# EAGLE design Adafruit Motor Bonnet Rev A (EAGLE 9.2.2)
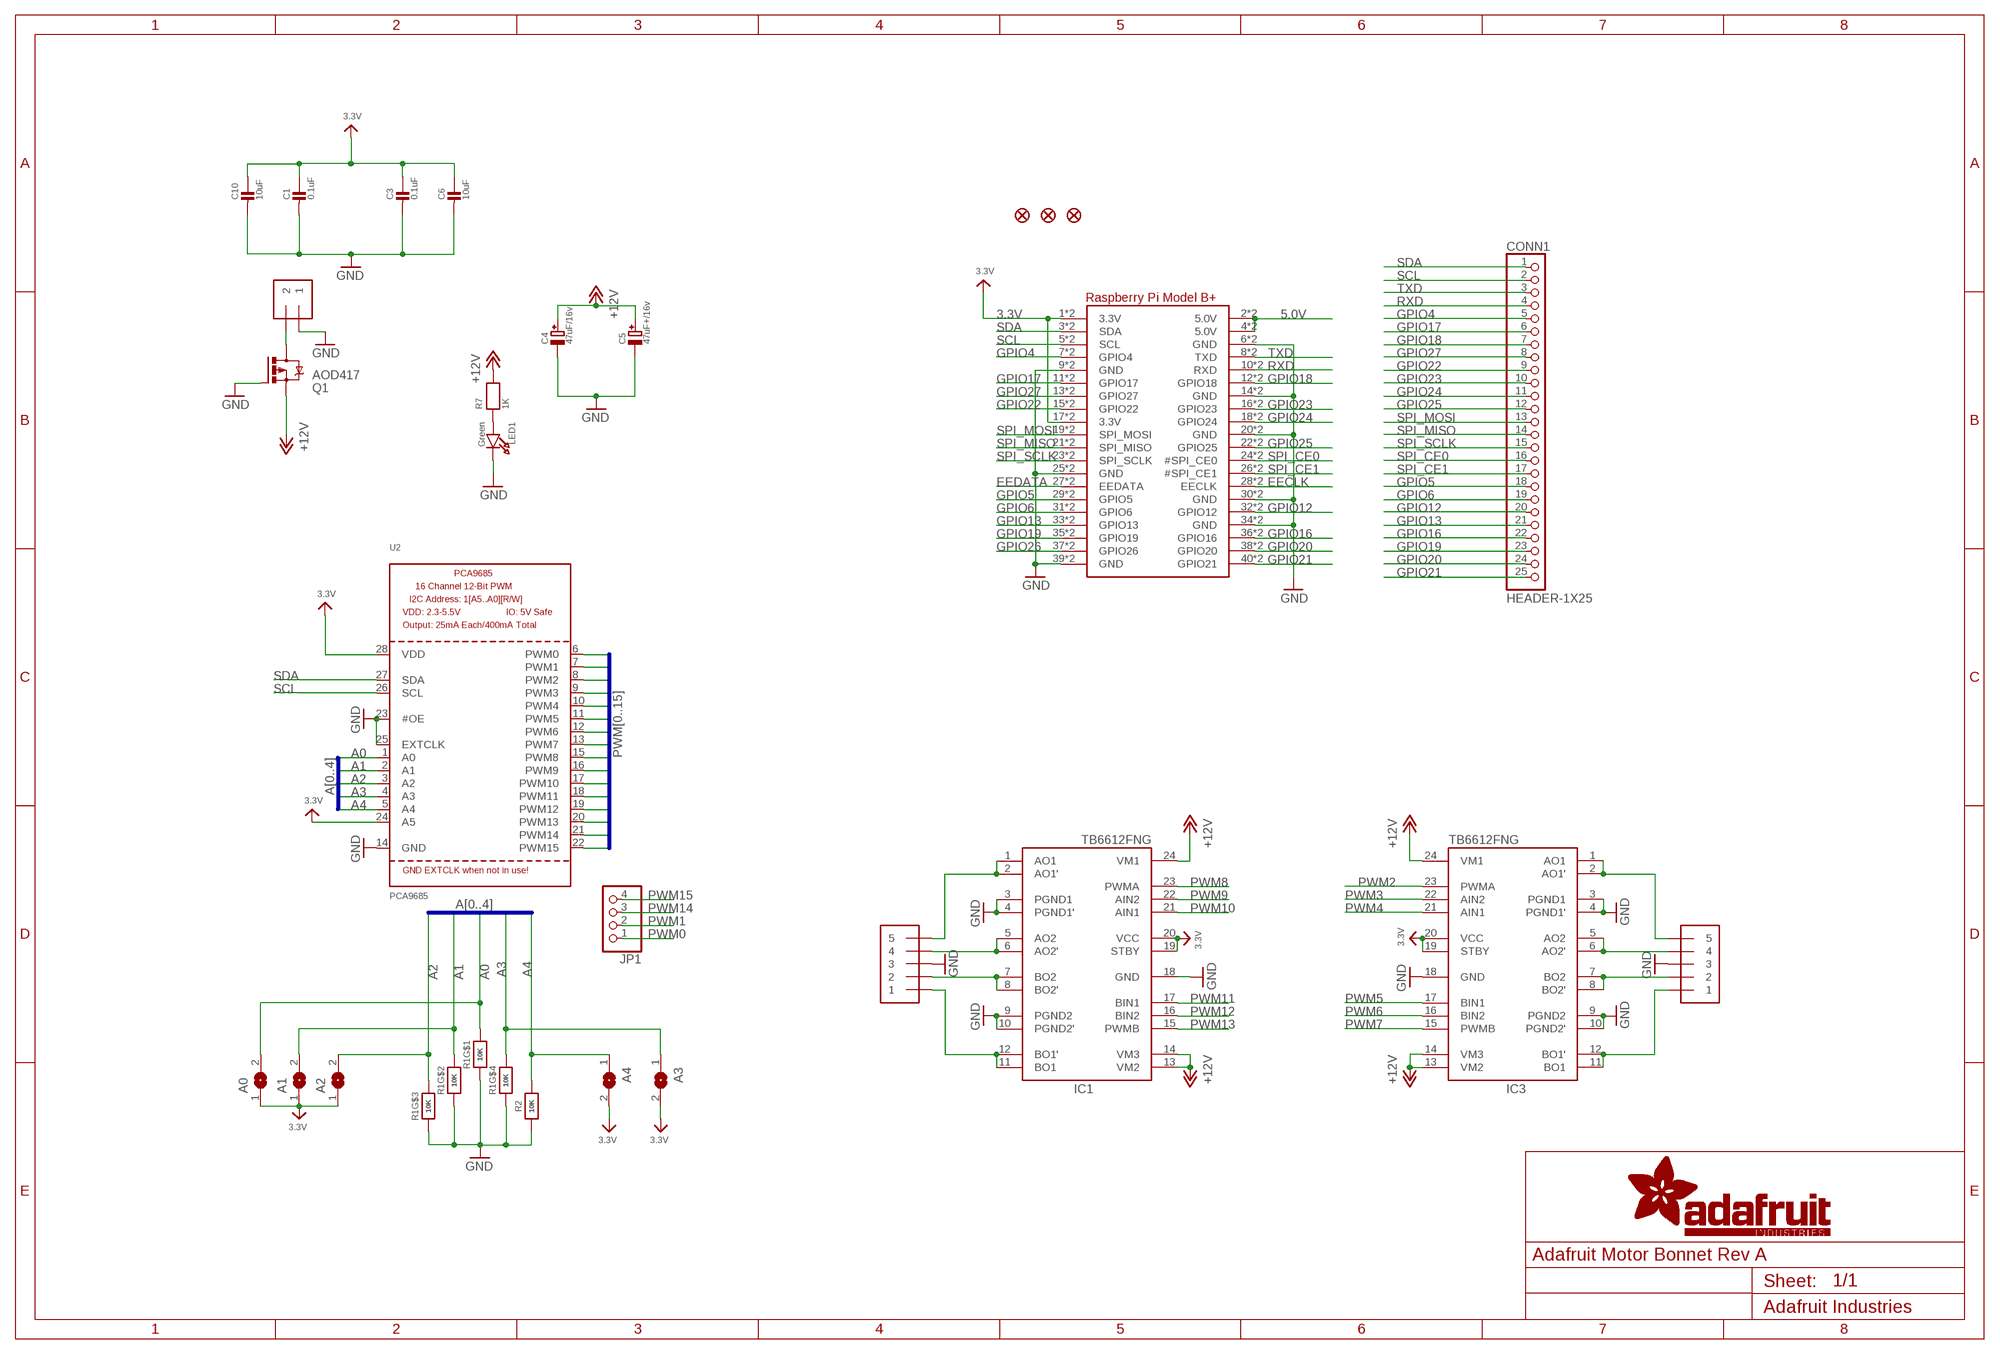
[diagram p0: schematic, sheet 1]

## Parts
A0  SOLDERJUMPERREFLOW_NOPASTE  [SOLDERJUMPER_REFLOW_NOPASTE]
A1  SOLDERJUMPERREFLOW_NOPASTE  [SOLDERJUMPER_REFLOW_NOPASTE]
A2  SOLDERJUMPERREFLOW_NOPASTE  [SOLDERJUMPER_REFLOW_NOPASTE]
A3  SOLDERJUMPERREFLOW_NOPASTE  [SOLDERJUMPER_REFLOW_NOPASTE]
A4  SOLDERJUMPERREFLOW_NOPASTE  [SOLDERJUMPER_REFLOW_NOPASTE]
C1  0.1uF  CAP_CERAMIC0603_NO  [0603-NO]
C3  0.1uF  CAP_CERAMIC0603_NO  [0603-NO]
C4  47uF/16v  CAP_ELECTROLYTICPANASONIC_C  [PANASONIC_C]
C5  47uF+/16v  CAP_ELECTROLYTICPANASONIC_C  [PANASONIC_C]
C6  10uF  CAP_CERAMIC0805-NOOUTLINE  [0805-NO]
C10  10uF  CAP_CERAMIC0805-NOOUTLINE  [0805-NO]
CONN1  HEADER-1X25  [1X25_ROUND_70MIL]
FID1  FIDUCIAL_1MM  [FIDUCIAL_1MM]
FID2  FIDUCIAL_1MM  [FIDUCIAL_1MM]
FID3  FIDUCIAL_1MM  [FIDUCIAL_1MM]
IC1  TB6612FNG  [SSOP24]
IC3  TB6612FNG  [SSOP24]
J1  1X5  [1X05-3.5MM]
J3  1X5  [1X05-3.5MM]
JP1  HEADER-1X4ROUND  [1X04_ROUND]
LED1  Green  LED0805_NOOUTLINE  [CHIPLED_0805_NOOUTLINE]
MPOWER  1X2-3.5MM  [1X2-3.5MM]
Q1  AOD417  IRFR5305  [D-PAK_TO252AA]
R1  10K  RESISTOR_4PACK  [RESPACK_4X0603]
R2  10K  RESISTOR_0603_NOOUT  [0603-NO]
R7  1K  RESISTOR_0603_NOOUT  [0603-NO]
RPI1  RASPBERRYPI_BPLUS_BONNET_THMSMT  [PI_BONNET_THMSMT]
U2  PCA9685  [TSSOP28]

## Nets
3.3V: A0.1 A1.1 A2.1 A3.2 A4.2 C1.1 C3.1 C6.1 C10.1 IC1.19(STBY) IC1.20(VCC) IC3.19(STBY) IC3.20(VCC) RPI1.1(3.3V) RPI1.17(3.3V) RPI1.S1(3.3V) RPI1.S17(3.3V) U2.24(A5) U2.28(VDD)
5.0V: RPI1.2(5.0V) RPI1.4(5.0V) RPI1.S2(5.0V) RPI1.S4(5.0V)
+12V: C4.+ C5.+ IC1.13(VM2) IC1.14(VM3) IC1.24(VM1) IC3.13(VM2) IC3.14(VM3) IC3.24(VM1) Q1.3(S) R7.2
A0: A0.2 R1.8 U2.1(A0)
A1: A1.2 R1.7 U2.2(A1)
A2: A2.2 R1.6 U2.3(A2)
A3: A3.1 R1.5 U2.4(A3)
A4: A4.1 R2.2 U2.5(A4)
EECLK: RPI1.28(EECLK) RPI1.S28(EECLK)
EEDATA: RPI1.27(EEDATA) RPI1.S27(EEDATA)
GND: C1.2 C3.2 C4.- C5.- C6.2 C10.2 IC1.3(PGND1) IC1.4(PGND1') IC1.9(PGND2) IC1.10(PGND2') IC1.18(GND) IC3.3(PGND1) IC3.4(PGND1') IC3.9(PGND2) IC3.10(PGND2') IC3.18(GND) J1.3 J3.3 LED1.C MPOWER.1 Q1.1(G) R1.1 R1.2 R1.3 R1.4 R2.1 RPI1.6(GND) RPI1.9(GND) RPI1.14(GND) RPI1.20(GND) RPI1.25(GND) RPI1.30(GND) RPI1.34(GND) RPI1.39(GND) RPI1.S6(GND) RPI1.S9(GND) RPI1.S14(GND) RPI1.S20(GND) RPI1.S25(GND) RPI1.S30(GND) RPI1.S34(GND) RPI1.S39(GND) U2.14(GND) U2.23(#OE) U2.25(EXTCLK)
GPIO4: CONN1.5 RPI1.7(GPIO4) RPI1.S7(GPIO4)
GPIO5: CONN1.18 RPI1.29(GPIO5) RPI1.S29(GPIO5)
GPIO6: CONN1.19 RPI1.31(GPIO6) RPI1.S31(GPIO6)
GPIO12: CONN1.20 RPI1.32(GPIO12) RPI1.S32(GPIO12)
GPIO13: CONN1.21 RPI1.33(GPIO13) RPI1.S33(GPIO13)
GPIO16: CONN1.22 RPI1.36(GPIO16) RPI1.S36(GPIO16)
GPIO17: CONN1.6 RPI1.11(GPIO17) RPI1.S11(GPIO17)
GPIO18: CONN1.7 RPI1.12(GPIO18) RPI1.S12(GPIO18)
GPIO19: CONN1.23 RPI1.35(GPIO19) RPI1.S35(GPIO19)
GPIO20: CONN1.24 RPI1.38(GPIO20) RPI1.S38(GPIO20)
GPIO21: CONN1.25 RPI1.40(GPIO21) RPI1.S40(GPIO21)
GPIO22: CONN1.9 RPI1.15(GPIO22) RPI1.S15(GPIO22)
GPIO23: CONN1.10 RPI1.16(GPIO23) RPI1.S16(GPIO23)
GPIO24: CONN1.11 RPI1.18(GPIO24) RPI1.S18(GPIO24)
GPIO25: CONN1.12 RPI1.22(GPIO25) RPI1.S22(GPIO25)
GPIO26: RPI1.37(GPIO26) RPI1.S37(GPIO26)
GPIO27: CONN1.8 RPI1.13(GPIO27) RPI1.S13(GPIO27)
M1A: IC1.1(AO1) IC1.2(AO1') J1.5
M1B: IC1.5(AO2) IC1.6(AO2') J1.4
M2A: IC1.11(BO1) IC1.12(BO1') J1.1
M2B: IC1.7(BO2) IC1.8(BO2') J1.2
M3A: IC3.1(AO1) IC3.2(AO1') J3.5
M3B: IC3.5(AO2) IC3.6(AO2') J3.4
M4A: IC3.11(BO1) IC3.12(BO1') J3.1
M4B: IC3.7(BO2) IC3.8(BO2') J3.2
N$1: LED1.A R7.1
PWM0: JP1.1 U2.6(PWM0)
PWM1: JP1.2 U2.7(PWM1)
PWM2: IC3.23(PWMA) U2.8(PWM2)
PWM3: IC3.22(AIN2) U2.9(PWM3)
PWM4: IC3.21(AIN1) U2.10(PWM4)
PWM5: IC3.17(BIN1) U2.11(PWM5)
PWM6: IC3.16(BIN2) U2.12(PWM6)
PWM7: IC3.15(PWMB) U2.13(PWM7)
PWM8: IC1.23(PWMA) U2.15(PWM8)
PWM9: IC1.22(AIN2) U2.16(PWM9)
PWM10: IC1.21(AIN1) U2.17(PWM10)
PWM11: IC1.17(BIN1) U2.18(PWM11)
PWM12: IC1.16(BIN2) U2.19(PWM12)
PWM13: IC1.15(PWMB) U2.20(PWM13)
PWM14: JP1.3 U2.21(PWM14)
PWM15: JP1.4 U2.22(PWM15)
RXD: CONN1.4 RPI1.10(RXD) RPI1.S10(RXD)
SCL: CONN1.2 RPI1.5(SCL) RPI1.S5(SCL) U2.26(SCL)
SDA: CONN1.1 RPI1.3(SDA) RPI1.S3(SDA) U2.27(SDA)
SPI_CE0: CONN1.16 RPI1.24(#SPI_CE0) RPI1.S24(#SPI_CE0)
SPI_CE1: CONN1.17 RPI1.26(#SPI_CE1) RPI1.S26(#SPI_CE1)
SPI_MISO: CONN1.14 RPI1.21(SPI_MISO) RPI1.S21(SPI_MISO)
SPI_MOSI: CONN1.13 RPI1.19(SPI_MOSI) RPI1.S19(SPI_MOSI)
SPI_SCLK: CONN1.15 RPI1.23(SPI_SCLK) RPI1.S23(SPI_SCLK)
TXD: CONN1.3 RPI1.8(TXD) RPI1.S8(TXD)
VMOTOR: MPOWER.2 Q1.4(D)

## Buses
PWM[0..15]
A[0..4]

## Library data of the parts
A0 A1-A4 = microbuilder:SOLDERJUMPER: SMD Solder JUMPER Solder the two pads together to create a connection, or remove the solder to break it. REFLOW - Use this footprint for solder paste and reflow ovens. WAVE - Use this footprint for hand-soldering (larger pads). CLOSED - Has a trace between the two pads to ensure it is closed by default. The trace needs to be cut to disable the jumper, and can be closed again by creating a solder bridge between the two pads.
C1 C3 C6 C10 = microbuilder:CAP_CERAMIC: Ceramic Capacitors For new designs, use the packages preceded by an '_' character since they are more reliable: The following footprints should be used on most boards: _0402 - Standard footprint for regular board layouts _0603 - Standard footprint for regular board layouts _0805 - Standard footprint for regular board layouts _1206 - Standard footprint for regular board layouts For extremely tight-pitch boards where space is at a premium, the following 'micro-pitch' footprints can be used (smaller pads, no silkscreen outline, etc.): _0402MP - Micro-pitch footprint for very dense/compact boards _0603MP - Micro-pitch footprint for very dense/compact boards _0805MP - Micro-pitch footprint for very dense/compact boards _1206MP - Micro-pitch footprint for very dense/compact boards
C4 C5 = microbuilder:CAP_ELECTROLYTIC: Electrolytic Capacitors SMT PANASONIC_C - Size C Panasonic Electrolytic Aluminum Capacitor 47µF 16V 20% Electrolytic Capacitor [Digikey: PCE3890TR-ND] PANASONIC_D - Size D Panasonic Electrolytic Aluminum Capacitor 100µF 25V 20% Electrolytic Capacitor [Digikey: PCE3898TR-ND] PTH 3.5 mm grid, 8 mm diameter ... 3.5 mm grid, 10 mm diameter ...
CONN1 = microbuilder:HEADER-1X25
FID1-FID3 = microbuilder:FIDUCIAL: Fiducial Alignment Points Various fiducial points for machine vision alignment.; BOM: EXCLUDE
IC1 IC3 = adafruit:TB6612FNG: TB6612FNG MOS dual H-bridge motor driver, 1.2A current 3.2A peak 3 or 5v logic and 3-15v motor
J1 J3 = adafruit:1X5
JP1 = microbuilder:HEADER-1X4: PIN HEADER
LED1 = microbuilder:LED: LED 0603 - 0603 Surface Mount Package 2mA: Green LED - Low Power (3.9mcd, 2ma, 1.7Vf) - Digikey: 475-2709-2-ND Orange LED - Low Power (9.8mcd, 2ma, 1.8Vf) - Digikey: 475-1194-2-ND Red LED - Low Power (5mcd, 2ma, 1.8Vf) - Digikey: 475-1195-2-ND Yellow LED - Low Power (7mcd, 2ma, 1.8Vf) - Digikey: 475-1196-2-ND 5mA: Blue LED - Low Power (17mcd, 5ma, 2.9Vf) - Digikey: LNJ937W8CRACT-ND 0805 - 0805 Surface Mount Package 2mA: Red LED (8.8mcd, 2mA, 1.8Vf, Clear) - Low Power [Digikey: 475-2510-1-ND] Green LED (5mcd, 2mA, 1.8Vf, Clear) - Low Power [Digikey: 475-2730-1-ND] Yellow LED (11.3mcd, 2mA, 1.8Vf, Clear) - Low Power [Digikey: 475-2555-1-ND] 20mA: Red LED (104mcd, 20mA, Diffused) - LS R976 [Digikey: 475-1278-6-ND] Red LED (12mcd, 20mA, 2.0Vf, Clear) - APT2012EC [Digikey: 754-1128-1-ND] Green LED (15mcd, 20mA, 2.2Vf, Clear) - APT2012GC [Digikey: 754-1131-1-ND] Orange LED (160mcd, 20mA, 2.1Vf, Clear) - APT2012SECK [Digikey: 754-1130-1-ND] 1206 - 1206 Surface Mount Package Green LED (26mcd, 20mA, Diffused) - LG N971 [Digikey: 475-1407-6-ND] Red LED (15mcd, 20mA, Diffused) - LH N974 [Digikey: 475-1416-6-ND] Cree - Cree High-Power Surface Mount LEDs XPEBWT-L1-0000-00D50 - White 111lm 350mA 2.9Vf 6200K 110° XTEAWT-00-0000-00000LEE3 - White 114lm 350mA 2.85Vf 5000K 115° Everlight - Everlight 45-21 Series Surface Mount LEDs 45-21/QK2C-B2832AC2CB2/2T - Warm White 2000mcd 20mA 3.25Vf 3050K 120° 45-21/LK2C-B38452C4CB2/2T - Nuetral White 2000mcd 20mA 3.25Vf 4150K 120° 45-21/LK2C-B50634C6CB2/2T - Cold White 2200mcd 20mA 3.25Vf 5650K 120° PLCC2 Reverse Mount LS T77K-J1L2-1-0-2-R18-Z - Red 11.25mcd 2mA 1.8Vf 630nm 120° LO T77K-L1M2-24-Z - Orange 19.6mcd 2mA 1.8Vf 606nm 120° LY T77K-K2M1-26-Z - Yellow 15.7mcd 2mA 1.8Vf 587nm 120°
MPOWER = adafruit:1X2: 3.5mm Terminal block http://www.ladyada.net/library/pcb/eaglelibrary.html
Q1 = transistor-power:IRF?5305: HEXFET Power MOSFET Source: http://www.irf.com/product-info/datasheets/data/irfr5305pbf.pdf
R1 = microbuilder:RESISTOR_4PACK: Resistor Packs (4 resistors) 4 x 0603 10K 1/16W - Digikey: YC164J-10KCT-ND
R2 R7 = microbuilder:RESISTOR: Resistors For new designs, use the packages preceded by an '_' character since they are more reliable: The following footprints should be used on most boards: _0402 - Standard footprint for regular board layouts _0603 - Standard footprint for regular board layouts _0805 - Standard footprint for regular board layouts _1206 - Standard footprint for regular board layouts For extremely tight-pitch boards where space is at a premium, the following 'micro-pitch' footprints can be used (smaller pads, no silkscreen outline, etc.): _0402MP - Micro-pitch footprint for very dense/compact boards _0603MP - Micro-pitch footprint for very dense/compact boards _0805MP - Micro-pitch footprint for very dense/compact boards _1206MP - Micro-pitch footprint for very dense/compact boards
RPI1 = microbuilder:RASPBERRYPI_BPLUS
U2 = microbuilder:PCA9685: PCA9685 - 16 Channel 12-Bit I2C PWM Controller 5.0V tolerant 16 channel, 12-bit I2C PWM controller with 25mA per output (max. 400mA total) Digikey: 568-5931-1-ND

## Board
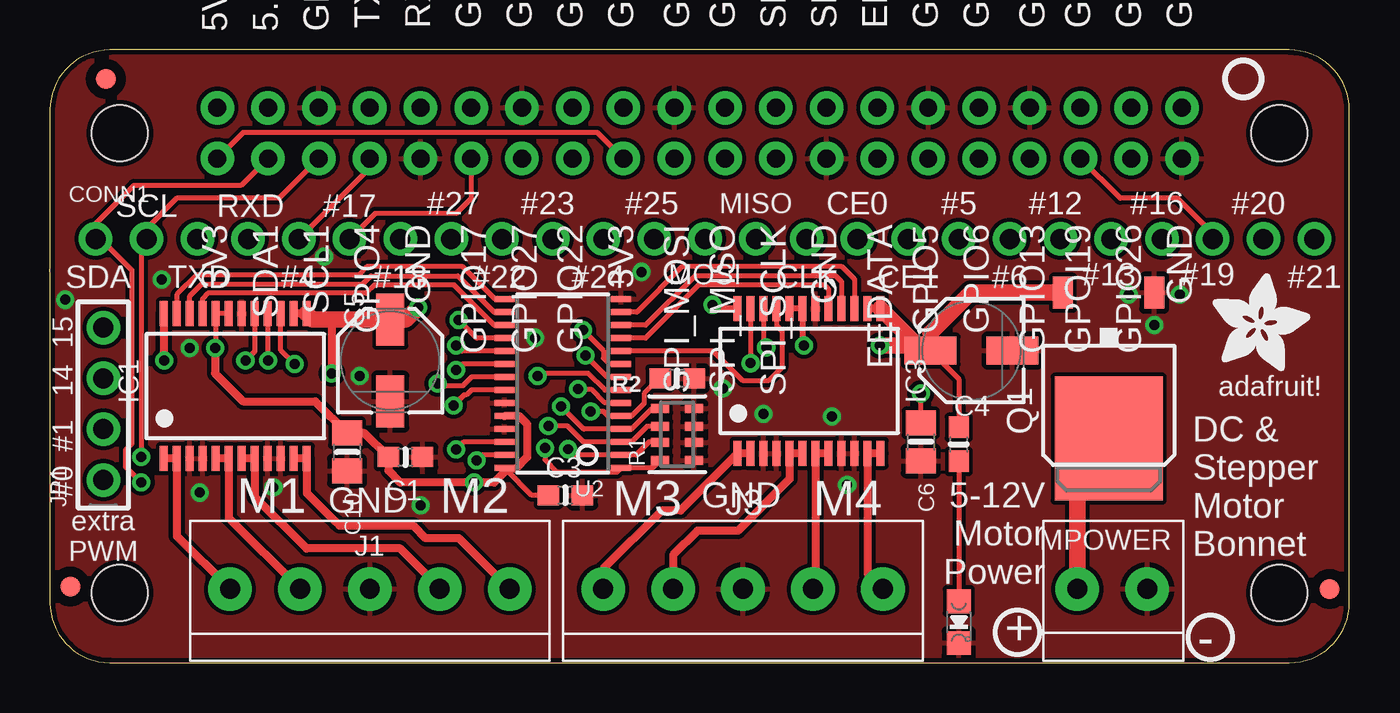
[diagram p1: board, top side]
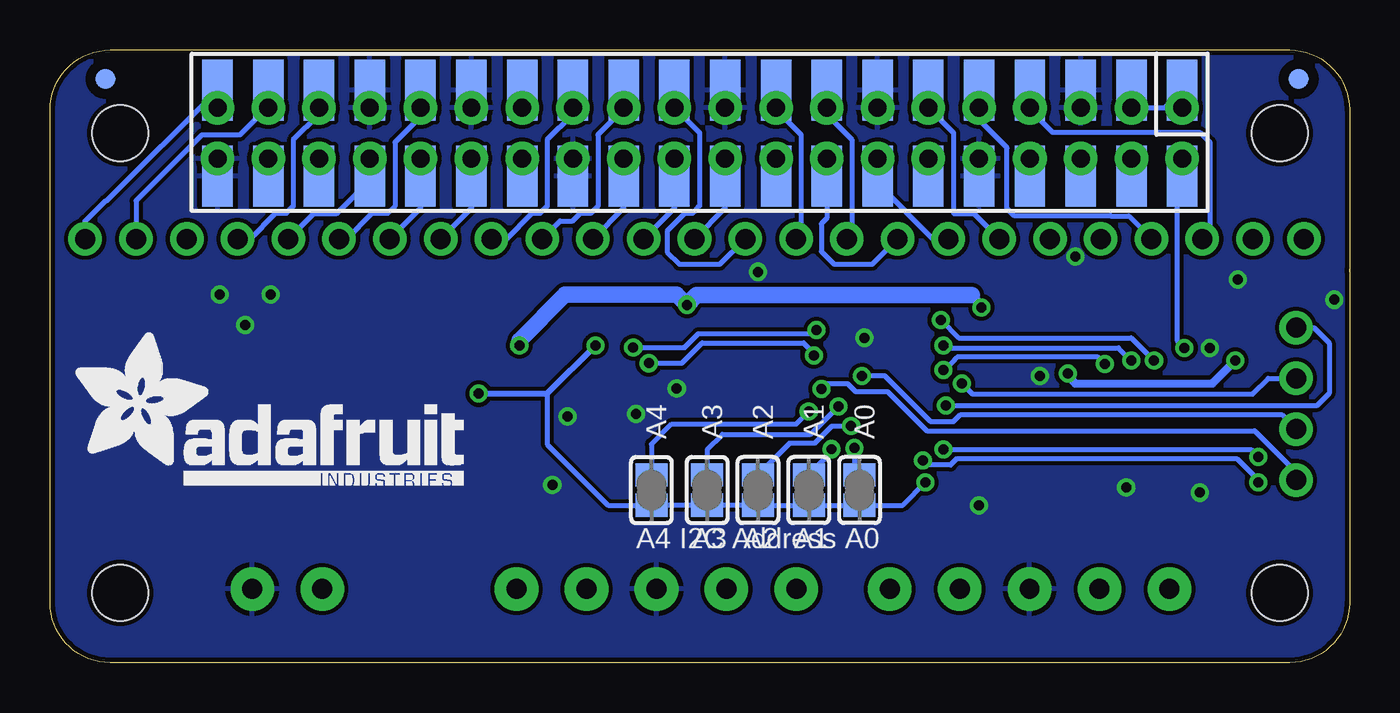
[diagram p2: board, bottom side, seen from below]

Size 65 x 30.66 mm. Coordinates in mm from the lower left corner, seen from the top.
Outline: 0,19.56 0,19.68
Copper layers (1*16): Top 0.035mm / dielectric 1.5mm / Bottom 0.035mm
Design rules "adafruit *": minimum track width 8mil, minimum drill 15.5mil, track to track 8mil, track to pad 8mil, pad to pad 8mil, via to via 8mil, smd to smd 8mil, copper to edge 10mil, drill to drill 8mil, minimum pad ring 10mil, minimum via ring 8mil, stop-mask expansion 2mil, vias tented up to drill 20mil, thermal gap 10mil

### Footprints (pad centres in the part's own frame; a part is rotated, then mirrored left to right if it is on the bottom)
SOLDERJUMPER_REFLOW_NOPASTE = smd 1.168 x 1.6: 1 -0.762,0; 2 0.762,0
0603-NO = smd 1.075 x 1: 1 -0.85,0; 2 0.85,0
PANASONIC_C = smd 2.6 x 1.4: + 2.05,0; - -2.05,0
0805-NO = smd 1.24 x 1.5: 1 -0.95,0; 2 0.95,0
1X25_ROUND_70MIL = drill 1 pad 1.676: 1 -30.48,0; 2 -27.94,0; 3 -25.4,0; 4 -22.86,0; 5 -20.32,0; 6 -17.78,0; 7 -15.24,0; 8 -12.7,0; 9 -10.16,0; 10 -7.62,0; 11 -5.08,0; 12 -2.54,0; 13 0,0; 14 2.54,0; 15 5.08,0; 16 7.62,0; 17 10.16,0; 18 12.7,0; 19 15.24,0; 20 17.78,0; 21 20.32,0; 22 22.86,0; 23 25.4,0; 24 27.94,0; 25 30.48,0
FIDUCIAL_1MM = smd 1 x 1: 1 0,0
SSOP24 = smd 0.4 x 1.25: 1 -3.575,-3.625; 2 -2.925,-3.625; 3 -2.275,-3.625; 4 -1.625,-3.625; 5 -0.975,-3.625; 6 -0.325,-3.625; 7 0.325,-3.625; 8 0.975,-3.625; 9 1.625,-3.625; 10 2.275,-3.625; 11 2.925,-3.625; 12 3.575,-3.625; 13 3.575,3.625; 14 2.925,3.625; 15 2.275,3.625; 16 1.625,3.625; 17 0.975,3.625; 18 0.325,3.625; 19 -0.325,3.625; 20 -0.975,3.625; 21 -1.625,3.625; 22 -2.275,3.625; 23 -2.925,3.625; 24 -3.575,3.625
1X05-3.5MM = drill 1 pad 2.184: 1 7,0; 2 3.5,0; 3 0,0; 4 -3.5,0; 5 -7,0
1X04_ROUND = drill 1 pad 1.676: 1 -3.81,0; 2 -1.27,0; 3 1.27,0; 4 3.81,0
CHIPLED_0805_NOOUTLINE = smd 1.2 x 1.2: A 0,-1.05; C 0,1.05
1X2-3.5MM = drill 1 pad 2.184: 1 1.8,0; 2 -1.7,0
D-PAK_TO252AA = smd 1 x 1.6: 1 -2.28,-4.8; 3 2.28,-4.8 | smd 5.4 x 6.2: 4 0,2.5
RESPACK_4X0603 = smd 0.45 x 0.9: 1 -1.3,-0.85; 2 -0.4,-0.85; 3 0.4,-0.85; 4 1.3,-0.85; 5 1.3,0.85; 6 0.4,0.85; 7 -0.4,0.85; 8 -1.3,0.85
PI_BONNET_THMSMT = drill 0.9 pad 1.676: 1 8.37,25.23; 2 8.37,27.77; 3 10.91,25.23; 4 10.91,27.77; 5 13.45,25.23; 6 13.45,27.77; 7 15.99,25.23; 8 15.99,27.77; 9 18.53,25.23; 10 18.53,27.77; 11 21.07,25.23; 12 21.07,27.77; 13 23.61,25.23; 14 23.61,27.77; 15 26.15,25.23; 16 26.15,27.77; 17 28.69,25.23; 18 28.69,27.77; 19 31.23,25.23; 20 31.23,27.77; 21 33.77,25.23; 22 33.77,27.77; 23 36.31,25.23; 24 36.31,27.77; 25 38.85,25.23; 26 38.85,27.77; 27 41.39,25.23; 28 41.39,27.77; 29 43.93,25.23; 30 43.93,27.77; 31 46.47,25.23; 32 46.47,27.77; 33 49.01,25.23; 34 49.01,27.77; 35 51.55,25.23; 36 51.55,27.77; 37 54.09,25.23; 38 54.09,27.77; 39 56.63,25.23; 40 56.63,27.77 | smd 1 x 1 bottom: 41 2.54,29.21; 42 62.23,29.21 | smd 1.524 x 3.048 bottom: S1 8.37,24.339; S2 8.37,28.657; S3 10.91,24.339; S4 10.91,28.657; S5 13.45,24.339; S6 13.45,28.657; S7 15.99,24.339; S8 15.99,28.657; S9 18.53,24.339; S10 18.53,28.657; S11 21.07,24.339; S12 21.07,28.657; S13 23.61,24.339; S14 23.61,28.657; S15 26.15,24.339; S16 26.15,28.657; S17 28.69,24.339; S18 28.69,28.657; S19 31.23,24.339; S20 31.23,28.657; S21 33.77,24.339; S22 33.77,28.657; S23 36.31,24.339; S24 36.31,28.657; S25 38.85,24.339; S26 38.85,28.657; S27 41.39,24.339; S28 41.39,28.657; S29 43.93,24.339; S30 43.93,28.657; S31 46.47,24.339; S32 46.47,28.657; S33 49.01,24.339; S34 49.01,28.657; S35 51.55,24.339; S36 51.55,28.657; S37 54.09,24.339; S38 54.09,28.657; S39 56.63,24.339; S40 56.63,28.657 | hole 2.8: 3.5,26.5; 61.5,26.5; 61.5,3.5; 3.5,3.5
TSSOP28 = smd 0.305 x 0.991: 1 -4.225,-2.918; 2 -3.575,-2.918; 3 -2.925,-2.918; 4 -2.275,-2.918; 5 -1.625,-2.918; 6 -0.975,-2.918; 7 -0.325,-2.918; 8 0.325,-2.918; 9 0.975,-2.918; 10 1.625,-2.918; 11 2.275,-2.918; 12 2.925,-2.918; 13 3.575,-2.918; 14 4.225,-2.918; 15 4.225,2.918; 16 3.575,2.918; 17 2.925,2.918; 18 2.275,2.918; 19 1.625,2.918; 20 0.975,2.918; 21 0.325,2.918; 22 -0.325,2.918; 23 -0.975,2.918; 24 -1.625,2.918; 25 -2.275,2.918; 26 -2.925,2.918; 27 -3.575,2.918; 28 -4.225,2.918

### Placement (x,y rotation side)
A0  24.51,8.64 90 bottom
A1  27.05,8.64 90 bottom
A2  29.59,8.64 90 bottom
A3  32.13,8.64 270 bottom
A4  34.92,8.64 270 bottom
C1  17.78,10.29 0 top
C3  25.78,8.38 0 top
C4  46.1,15.62 180 top
C5  17.02,15.11 90 top
C6  43.56,11.05 270 top
C10  14.86,10.54 270 top
CONN1  32.77,21.21 0 top
FID1  2.79,29.21 0 top
FID2  64.01,3.68 0 top
FID3  1.02,3.81 0 top
IC1  9.27,13.84 0 top
IC3  37.97,14.1 0 top
J1  16,3.68 0 top
J3  34.67,3.68 0 top
JP1  2.67,12.95 90 top
LED1  45.47,2.03 180 top
MPOWER  53.09,3.68 0 top
Q1  52.96,13.72 180 top
R1  31.37,11.43 90 top
R2  31.37,14.22 180 top
R7  45.47,10.92 90 top
RPI1  0,0 0 top
U2  25.65,13.97 90 top
U$6  [PCBFEAT-REV-040]  59.69,29.21 0 top
U$8  [ADAFRUIT_TEXT_20MM]  63.88,8.89 0 bottom
U$51  [ADAFRUIT_5MM]  58.17,14.61 0 top

### Tracks (layer width: path | path; a pad name or v marks a point on that pad's centre or on a via)
3.3V  (via drill 0.5)
  Top 0.254: U2.28 22.78,9.7 22.84,9.64 24.1,8.38 C3.1 | IC1.19 IC1.20 8.3,15.79 | 8.3,15.79 v8.26,15.75 8.3,15.79 | RPI1.1 9.68,26.54 27.38,26.54 RPI1.17 | C6.1 v43.56,13.46
  Top 0.305: IC3.20 IC3.19 37.65,15.95 v37.72,15.88 | 43.34,12.22 C6.1
  Top 0.406: 22.84,9.64 22.23,9.02 v21.21,9.02 17.53,9.02 16.93,9.61 C1.1 15.73,11.49 C10.1 13.27,13.08 9.65,13.08 8.26,14.48 v8.26,15.75 | U2.24 23.47,12.35 23.88,11.94 23.88,10.29 23.29,9.7 22.78,9.7
  Bottom 0.254: v8.26,15.75 8.64,16.13 8.64,24.07 RPI1.S1 RPI1.1 | 40.13,13.46 40.13,10.92 37.08,7.87 A4.2 A3.2 A2.1 A1.1 A0.1 22.35,7.87 v21.21,9.02 | RPI1.S17 RPI1.17
  Bottom 0.305: v37.72,15.88 40.13,13.46 v43.56,13.46
5.0V
  Bottom 0.254: RPI1.S2 | RPI1.S2 RPI1.2 | RPI1.S2 9.26,27.77 RPI1.4 RPI1.S4 | RPI1.S4
+12V  (via drill 0.5)
  Top 0.254: C4.+ 45.47,14.21 R7.2
  Top 0.305: IC3.24 33.33,17.72 v33.15,17.91 | C4.+ 43.8,15.88
  Top 0.406: IC1.13 IC1.14 | IC1.24 5.7,15.13 v5.71,15.11 | v14.1,14.48 14.1,17.04 13.97,17.16 | IC3.13 IC3.14 | 43.65,15.62 C4.+ 44.05,16.49 | 17.8,17.16 C5.+
  Top 0.813: C5.+ 13.97,17.16 13.15,17.16 IC1.13 | 43.65,15.62 IC3.13 | 43.8,15.88 v41.53,15.88 | Q1.3 46.08,18.52 44.05,16.49 | v18.41,17.78 17.8,17.16
  Bottom 0.406: v5.71,15.11 6.86,13.97 13.72,13.97 14.1,14.35 v14.1,14.48 | 18.89,18.39 18.29,17.78 v18.41,17.78
  Bottom 0.813: v41.53,15.88 41.53,16.13 39.24,18.41 33.66,18.41 v33.15,17.91 32.67,18.39 18.89,18.39
A0  (via drill 0.5)
  Top 0.254: R1.8 30.13,9.74 U2.1 28.35,9.53 25.4,9.53 24.77,10.16 v24.77,10.73
  Bottom 0.254: v24.77,10.73 24.77,9.46 24.7,9.4 A0.2
A1  (via drill 0.5)
  Top 0.254: R1.7 30.5,11.05 29.97,11.05 29.32,10.39 U2.2 26.2,10.39 v25.91,10.68
  Bottom 0.254: v25.91,10.68 25.91,10.56 27.05,9.41 A1.2
A2  (via drill 0.5)
  Top 0.254: R1.6 29.86,11.83 29.08,11.04 U2.3 26.7,11.04 25.9,11.84 v24.93,11.84
  Bottom 0.254: v24.93,11.84 25.9,11.84 26.77,10.97 28.02,10.97 A2.2
A3  (via drill 0.5)
  Top 0.254: R1.5 30.12,12.73 29.08,11.7 U2.4 26.69,11.7 v25.56,12.83
  Bottom 0.254: A3.1 32.13,10.67 31.37,11.43 26.96,11.43 v25.56,12.83
A4  (via drill 0.5)
  Top 0.254: R2.2 30.48,14.22 29.72,13.46 29.72,12.98 29.09,12.35 U2.5 27.91,12.35 27.69,12.57 v27.05,12.57
  Bottom 0.254: v27.05,12.57 27.69,11.94 33.91,11.94 34.92,10.92 A4.1
EECLK
  Bottom 0.254: RPI1.S28 | RPI1.S28 RPI1.28
EEDATA
  Bottom 0.254: RPI1.S27 RPI1.27
GND  (via drill 0.5)
  Bottom 0.254: RPI1.S6 RPI1.6 | RPI1.6 | RPI1.9 RPI1.S9 | RPI1.9
  other vias: 0.76,18.16 29.59,19.56 13.72,20.32 6.99,15.75 5.59,19.18 7.49,8.51 18.54,7.87 15.49,14.35 24.26,16.26 35.69,12.45 33.66,13.72 39.12,12.32 39.88,8.89 11.18,8.76 53.98,18.41 55.24,16.89 56.52,18.41
  pour Top: 0,0 64.9,0 64.9,30.48 0,30.48
  pour Bottom: 0,0 64.9,0 64.9,30.48 0,30.48
GPIO4
  Top 0.254: RPI1.7 15.99,24.75 CONN1.5
  Bottom 0.254: RPI1.7 RPI1.S7 | RPI1.7
GPIO5
  Bottom 0.254: RPI1.29 RPI1.S29 43.93,22.75 CONN1.18 | RPI1.29
GPIO6
  Bottom 0.254: RPI1.31 RPI1.S31 46.47,22.75 CONN1.19
GPIO12
  Bottom 0.254: 46.47,28.19 RPI1.32 | 46.47,28.19 RPI1.S32 46.47,27.32 47.75,26.04 47.75,22.84 48.11,22.48 48.89,22.48 50.16,21.21 CONN1.20 | 46.47,28.19
GPIO13
  Bottom 0.254: RPI1.33 RPI1.S33 49.01,24.13 50.66,22.48 51.82,22.48 CONN1.21 | RPI1.33
GPIO16
  Bottom 0.254: RPI1.36 RPI1.S36 51.55,27.44 52.83,26.16 52.83,22.84 53.19,22.48 53.72,22.48 54.99,21.21 CONN1.22 | RPI1.36
GPIO17
  Top 0.254: CONN1.6 16.26,22.48 20.32,22.48 21.07,23.23 RPI1.11
  Bottom 0.254: RPI1.11 RPI1.S11 | RPI1.11
GPIO18
  Bottom 0.254: RPI1.S12 RPI1.12 | RPI1.12 | CONN1.7 18.8,22.48 19.81,22.48 19.81,26.51 RPI1.12
GPIO19
  Top 0.254: RPI1.35 53.54,23.24 56.39,23.24 58.17,21.46 CONN1.23
  Bottom 0.254: RPI1.35 RPI1.S35 | RPI1.35
GPIO20
  Bottom 0.254: RPI1.S38 | RPI1.S38 RPI1.38 | RPI1.S38 54.09,27.82 55.5,26.42 57.4,26.42 60.71,23.11 CONN1.24
GPIO21
  Bottom 0.254: RPI1.S40 | RPI1.S40 RPI1.40 | RPI1.S40 62.17,23.11 62.23,23.11 63.25,22.1 CONN1.25
GPIO22
  Bottom 0.203: RPI1.15 RPI1.S15 | RPI1.15
  Bottom 0.254: RPI1.S15 26.15,22.24 26.42,21.97 26.42,20.57 25.78,19.94 23.88,19.94 CONN1.9
GPIO23
  Bottom 0.254: RPI1.16 RPI1.S16 26.15,27.42 24.89,26.16 24.89,21.46 CONN1.10 | RPI1.16
GPIO24
  Bottom 0.254: RPI1.18 RPI1.S18 28.69,27.67 27.43,26.42 27.43,21.46 CONN1.11 | RPI1.18
GPIO25
  Bottom 0.254: RPI1.22 | RPI1.22 32.51,26.51 32.51,22.86 32.68,22.7 32.68,22.68 32.87,22.48 33.24,22.48 34.14,21.59 34.14,20.55 33.53,19.94 31.5,19.94 CONN1.12 | RPI1.S22 RPI1.22
GPIO26
  Bottom 0.254: RPI1.S37 RPI1.37
GPIO27
  Bottom 0.254: RPI1.13 RPI1.S13 23.61,23.99 20.83,21.21 CONN1.8 | RPI1.13
M1A
  Top 0.406: IC1.1 IC1.2 6.35,6.34 J1.5
M1B
  Top 0.254: IC1.6
  Top 0.406: IC1.5 IC1.6 8.95,7.24 J1.4
M2A
  Top 0.406: IC1.11 IC1.12 12.85,8.49 14.29,7.05 14.48,6.86 | J1.1 20.46,6.22 18.8,6.22 18.16,6.86 14.48,6.86 | 14.48,6.86
M2B
  Top 0.406: IC1.7 IC1.8 10.25,8.3 12.83,5.71 17.53,5.71 19.5,3.74 J1.2
M3A
  Top 0.406: IC3.2 IC3.1 31.55,7.62 30.61,7.62 27.67,4.68 J3.5
M3B
  Top 0.254: IC3.5
  Top 0.406: IC3.6 IC3.5 37,9.19 34.42,6.6 32.38,6.6 31.17,5.39 J3.4
M4A
  Top 0.406: IC3.12 IC3.11 40.9,4.46 J3.1
M4B
  Top 0.406: IC3.8 IC3.7 38.3,3.81 J3.2
N$1
  Top 0.254: R7.1 LED1.A
PWM0  (via drill 0.5)
  Top 0.254: v26.42,13.7 27.06,13.7 27.73,13.03 27.88,13.03 27.91,12.99 U2.6
  Bottom 0.254: v26.42,13.7 26.14,13.97 25.11,13.97 24.71,13.57 23.1,13.57 21.14,11.61 4.75,11.61 2.67,9.53 JP1.1
PWM1  (via drill 0.5)
  Top 0.254: U2.7 27.76,13.64 26.92,14.48 24.51,14.48 v24.38,14.35
  Bottom 0.254: v24.38,14.35 23.24,14.35 20.95,12.06 19.81,12.06 19.46,12.41 3.4,12.41 | 3.4,12.41 | JP1.2 3.11,12.13 3.4,12.41
PWM2  (via drill 0.5)
  Top 0.254: U2.8 27.87,14.29 v26.8,15.37 | v35.05,14.99 IC3.23
  Bottom 0.254: v35.05,14.99 33.4,14.99 32.38,16 27.3,16 26.73,15.43 v26.8,15.37
PWM3  (via drill 0.5)
  Top 0.254: U2.9 27.98,14.95 27.69,15.24 27.69,15.62 v26.67,16.64 | v35.83,15.78 35.7,15.91 IC3.22
  Bottom 0.254: v35.83,15.78 33.3,15.78 33.28,15.75 32.57,16.46 26.85,16.46 v26.67,16.64
PWM4
  Top 0.254: U2.10 33.17,15.6 34.67,14.1 35.94,14.1 36.62,14.77 36.62,16.6 36.35,16.86 IC3.21
PWM5
  Top 0.254: U2.11 29.8,16.25 32.45,18.9 38.73,18.9 38.95,18.68 IC3.17
PWM6
  Top 0.254: IC3.16 39.6,19.06 39.31,19.36 32.26,19.36 29.8,16.89 U2.12
PWM7
  Top 0.254: U2.13 29.36,17.55 31.62,19.81 39.62,19.81 40.25,19.19 IC3.15
PWM8
  Top 0.254: IC1.23 6.35,18.41 7.33,19.4 15.44,19.4 15.85,19.81 20.65,19.81 22.27,18.2 U2.15
PWM9
  Top 0.254: 22.27,17.55 U2.16 22.22,17.55 20.41,19.36 16.04,19.36 15.63,18.94 7.58,18.94 7,18.35 IC1.22
PWM10
  Top 0.254: U2.17 22.22,16.89 20.22,18.9 16.23,18.9 15.82,18.48 7.9,18.48 7.65,18.23 IC1.21
PWM11  (via drill 0.5)
  Top 0.254: IC1.17 10.25,15.58 v9.78,15.11 | v20.45,17.14 21.27,16.32 21.35,16.25 U2.18
  Bottom 0.254: v9.78,15.11 10.92,16.26 19.56,16.26 v20.45,17.14
PWM12  (via drill 0.5)
  Top 0.254: IC1.16 10.9,15.14 v10.92,15.11 | v20.32,15.88 20.6,15.6 U2.19
  Bottom 0.254: v10.92,15.11 11.56,15.75 20.19,15.75 v20.32,15.88
PWM13  (via drill 0.5)
  Top 0.254: v20.32,14.64 20.63,14.95 U2.20 | v12.24,14.94 11.55,15.63 IC1.15 | IC1.15
  Bottom 0.254: v12.24,14.94 12.59,15.29 19.63,15.29 | v20.32,14.64 20.29,14.64 19.75,15.18 19.63,15.29 | 19.63,15.29
PWM14  (via drill 0.5)
  Top 0.254: U2.21 21.08,14.29 20.64,13.86 19.39,13.86 v19.39,13.97
  Bottom 0.254: v19.39,13.97 18.86,13.44 4.85,13.44 4.06,14.22 JP1.3 | JP1.3
PWM15  (via drill 0.5)
  Top 0.254: U2.22 21.08,13.64 20.83,13.4 20.72,13.4 v20.19,12.87
  Bottom 0.254: v20.19,12.87 1.61,12.87 1.02,13.46 1.02,16 1.78,16.76 JP1.4
RXD
  Bottom 0.254: RPI1.10 RPI1.S10 18.53,27.17 17.14,25.78 17.14,25.73 17.16,25.71 17.16,22.75 16.78,22.38 11.96,22.38 11.94,22.35 11.05,22.35 CONN1.4 | RPI1.10
SCL  (via drill 0.5)
  Top 0.254: RPI1.5 11.46,23.24 6.35,23.24 4.83,21.72 CONN1.2 4.55,20.94 v4.55,10.3 | U2.26 20.7,11.04 v20.32,10.67
  Bottom 0.254: RPI1.S5 RPI1.5 | v20.32,10.67 4.92,10.67 v4.55,10.3
SDA  (via drill 0.5)
  Top 0.254: RPI1.3 9.56,23.88 4.19,23.88 2.29,21.97 CONN1.1 2.54,21.21 4.1,19.65 4.1,10.96 3.77,10.63 3.77,9.82 v4.57,9.02 | U2.27 21.62,10.39 v21.35,10.13
  Bottom 0.254: RPI1.S3 RPI1.3 | v4.57,9.02 4.45,9.02 5.64,10.21 19.63,10.21 19.96,9.88 21.11,9.88 v21.35,10.13
SPI_CE0
  Bottom 0.254: RPI1.24 RPI1.S24 36.31,27.7 37.59,26.42 37.59,22.84 37.95,22.48 38.48,22.48 38.86,22.1 39.5,22.1 CONN1.16 | RPI1.24
SPI_CE1
  Bottom 0.254: RPI1.26 RPI1.S26 38.85,27.44 40.13,26.16 40.13,22.84 40.49,22.48 40.89,22.48 42.16,21.21 CONN1.17 | RPI1.26
SPI_MISO
  Bottom 0.254: RPI1.21 RPI1.S21 33.77,22.75 CONN1.14 | RPI1.21
SPI_MOSI
  Bottom 0.254: RPI1.S19 31.23,22.75 CONN1.13 | RPI1.S19 | RPI1.S19 RPI1.19
SPI_SCLK
  Bottom 0.254: RPI1.23 RPI1.S23 36.31,22.75 CONN1.15 | RPI1.23
TXD
  Bottom 0.254: RPI1.S8 RPI1.8 | RPI1.8 | CONN1.3 6.99,21.59 6.99,26.04 7.49,26.54 14.86,26.54 15.99,27.67 RPI1.8
VMOTOR
  Top 0.406: Q1.4 51.39,9.64
  Top 0.813: 51.39,9.64 MPOWER.2

### Text on the board
tPlace: SCL | RXD | #17 | #27 | #23 | #25 | MISO | CE0 | #5 | #12 | #16 | #20 | SDA | TXD | #4 | #18 | #22 | #24 | MOSI | CLK | CE1 | #6 | #13 | #19 | #21 | 15 | adafruit! | 14 | #1 | M1 | GND | M2 | M3 | GND | M4 | #0 | extra / PWM | 5-12V / Motor / Power | DC & / Stepper / Motor / Bonnet | + | -
bPlace: A0 | A1 | A2 | A3 | A4 | I2C Address